# EAGLE design nled-dis-oled-v1a (EAGLE 9.1.0)
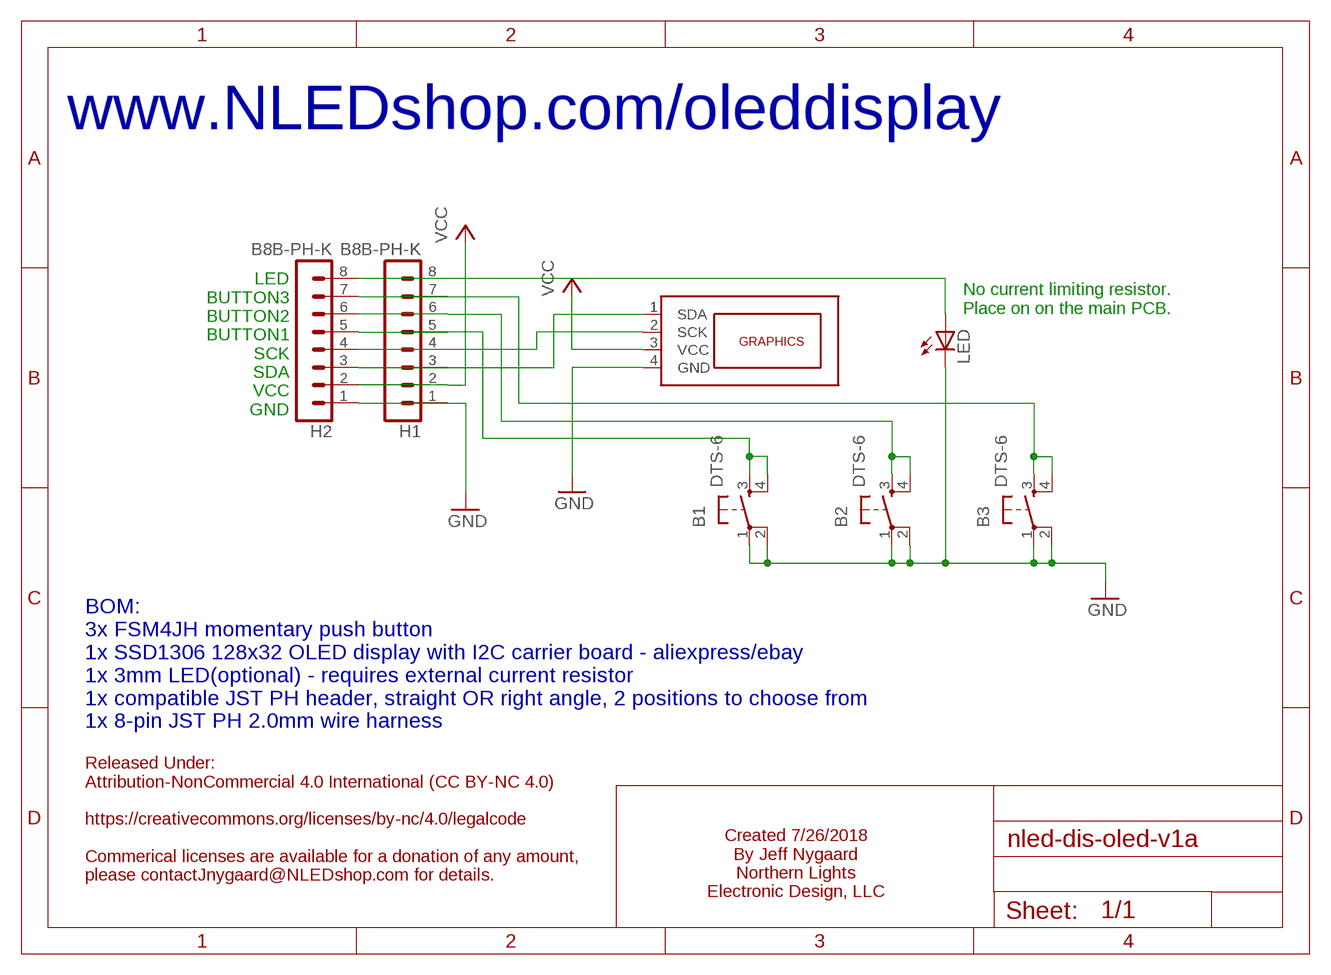
[diagram p0: schematic, sheet 1]

## Parts
B1  DTS-6  [DTS-6]
B2  DTS-6  [DTS-6]
B3  DTS-6  [DTS-6]
H1  B8B-PH-K  [B8B-PH-K]
H2  B8B-PH-K  [B8B-PH-K]
LED  LED3MM  [LED3MM]
OLED  OLED-128X32  [OLED-128X32]

## Nets
GND: B1.1 B1.2 B2.1 B2.2 B3.1 B3.2 H1.1 H2.1 LED.K(C) OLED.4(GND)
N$2: H1.8 H2.8 LED.A
N$3: B1.3 B1.4 H1.5 H2.5
N$4: B2.3 B2.4 H1.6 H2.6
N$5: B3.3 B3.4 H1.7 H2.7
N$8: H1.3 H2.3 OLED.1(SDA)
N$9: H1.4 H2.4 OLED.2(SCK)
VCC: H1.2 H2.2 OLED.3(VCC)

## Notes on the sheet
- www.NLEDshop.com/oleddisplay
- No current limiting resistor.
  Place on on the main PCB.
- LED
  BUTTON3
  BUTTON2
  BUTTON1
  SCK
  SDA
  VCC
  GND
- BOM:
  3x FSM4JH momentary push button
  1x SSD1306 128x32 OLED display with I2C carrier board - aliexpress/ebay
  1x 3mm LED(optional) - requires external current resistor
  1x compatible JST PH header, straight OR right angle, 2 positions to choose from
  1x 8-pin JST PH 2.0mm wire harness
- Created 7/26/2018
  By Jeff Nygaard
  Northern Lights
  Electronic Design, LLC
- Released Under:
  Attribution-NonCommercial 4.0 International (CC BY-NC 4.0)
  
  https://creativecommons.org/licenses/by-nc/4.0/legalcode
  
  Commerical licenses are available for a donation of any amount,
  please contactJnygaard@NLEDshop.com for details.

## Library data of the parts
B1-B3 = switch-tact:DTS-6
H1 H2 = con-jst-ph:B8B-PH-K: HEADER
LED = led:LED: LED OSRAM: - CHIPLED LG R971, LG N971, LY N971, LG Q971, LY Q971, LO R971, LY R971 LH N974, LH R974 LS Q976, LO Q976, LY Q976 LO Q996 - Hyper CHIPLED LW Q18S LB Q993, LB Q99A, LB R99A - SideLED LS A670, LO A670, LY A670, LG A670, LP A670 LB A673, LV A673, LT A673, LW A673 LH A674 LY A675 LS A676, LA A676, LO A676, LY A676, LW A676 LS A679, LY A679, LG A679 - Hyper Micro SIDELED® LS Y876, LA Y876, LO Y876, LY Y876 LT Y87S - SmartLED LW L88C, LW L88S LB L89C, LB L89S, LG L890 LS L89K, LO L89K, LY L89K LS L896, LA L896, LO L896, LY L896 - TOPLED LS T670, LO T670, LY T670, LG T670, LP T670 LSG T670, LSP T670, LSY T670, LOP T670, LYG T670 LG T671, LOG T671, LSG T671 LB T673, LV T673, LT T673, LW T673 LH T674 LS T676, LA T676, LO T676, LY T676, LB T676, LH T676, LSB T676, LW T676 LB T67C, LV T67C, LT T67C, LS T67K, LO T67K, LY T67K, LW E67C LS E67B, LA E67B, LO E67B, LY E67B, LB E67C, LV E67C, LT E67C LW T67C LS T679, LY T679, LG T679 LS T770, LO T770, LY T770, LG T770, LP T770 LB T773, LV T773, LT T773, LW T773 LH T774 LS E675, LA E675, LY E675, LS T675 LS T776, LA T776, LO T776, LY T776, LB T776 LHGB T686 LT T68C, LB T68C - Hyper Mini TOPLED® LB M676 - Mini TOPLED Santana® LG M470 LS M47K, LO M47K, LY M47K Source: http://www.osram.convergy.de LUXEON: - LUMILED® LXK2-PW12-R00, LXK2-PW12-S00, LXK2-PW14-U00, LXK2-PW14-V00 LXK2-PM12-R00, LXK2-PM12-S00, LXK2-PM14-U00 LXK2-PE12-Q00, LXK2-PE12-R00, LXK2-PE12-S00, LXK2-PE14-T00, LXK2-PE14-U00 LXK2-PB12-K00, LXK2-PB12-L00, LXK2-PB12-M00, LXK2-PB14-N00, LXK2-PB14-P00, LXK2-PB14-Q00 LXK2-PR12-L00, LXK2-PR12-M00, LXK2-PR14-Q00, LXK2-PR14-R00 LXK2-PD12-Q00, LXK2-PD12-R00, LXK2-PD12-S00 LXK2-PH12-R00, LXK2-PH12-S00 LXK2-PL12-P00, LXK2-PL12-Q00, LXK2-PL12-R00 Source: www.luxeon.com KINGBRIGHT: KA-3528ASYC Source: www.kingbright.com
OLED = NLED-modules:OLED-128X32

## Board
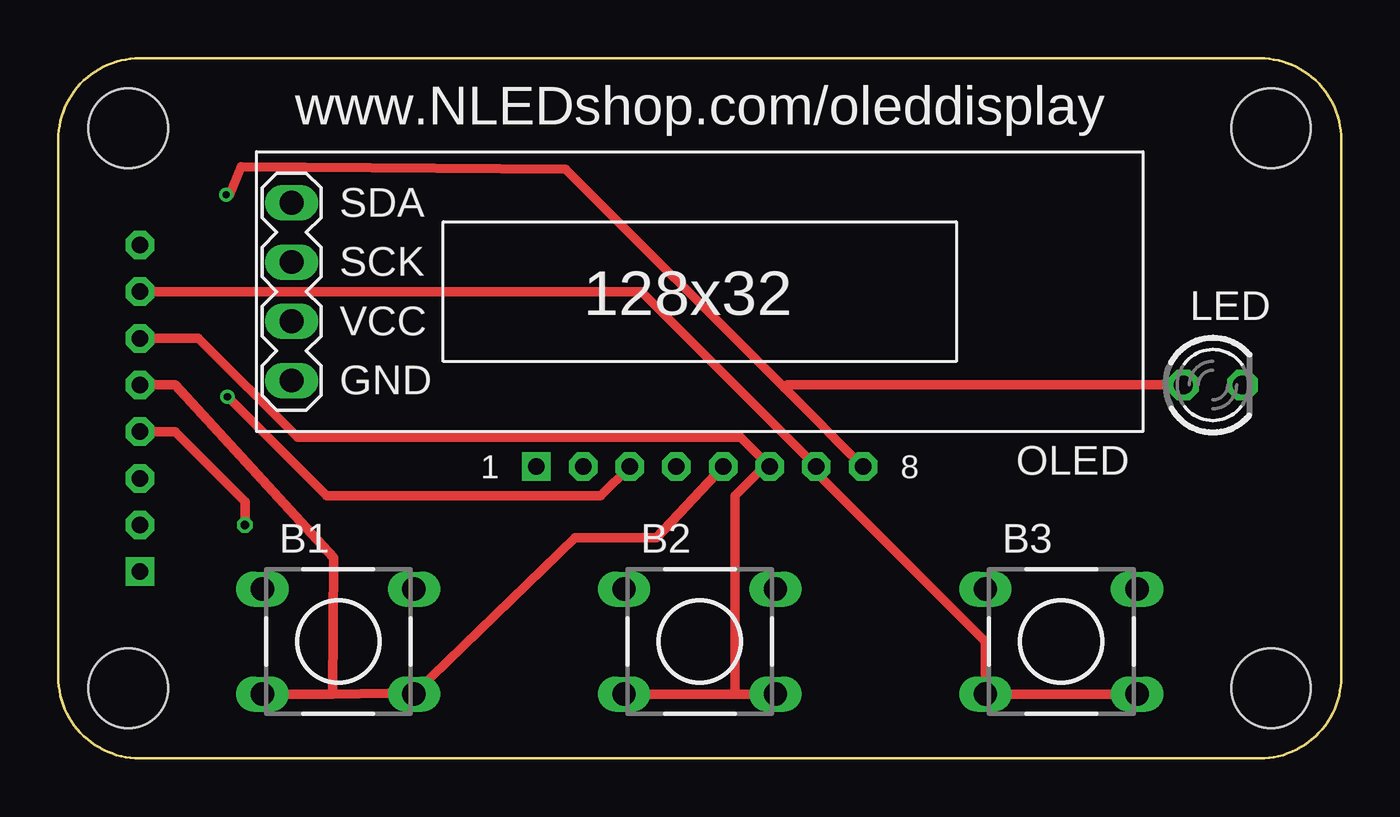
[diagram p1: board, top side]
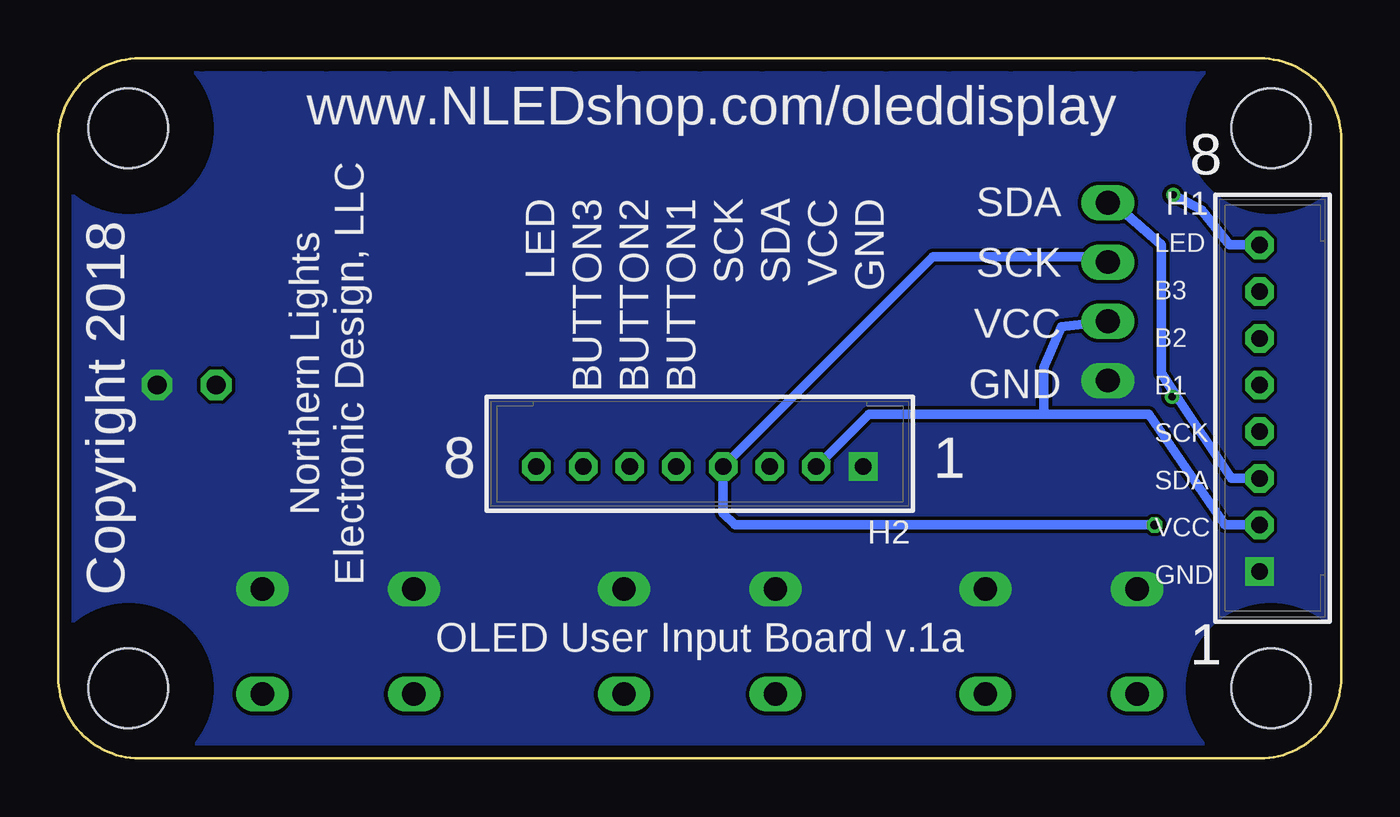
[diagram p2: board, bottom side, seen from below]

Size 55 x 30 mm. Coordinates in mm from the lower left corner, seen from the top.
Outline: 55,3.29 54.98,3.09 54.95,2.89 54.91,2.69 54.86,2.49 54.79,2.3 54.72,2.11 54.63,1.93 54.53,1.75 54.43,1.57 54.31,1.41 54.18,1.25 54.05,1.09 53.91,0.95 53.75,0.82 53.59,0.69 53.43,0.57 53.25,0.47 53.08,0.37 52.89,0.28 52.7,0.21 52.51,0.14 52.31,0.09 52.11,0.05 51.91,0.02 51.71,0 51.5,0 48.83,0 46.17,0 43.5,0 40.84,0 38.17,0 35.5,0 32.84,0 30.17,0 27.5,0 24.84,0 22.17,0 19.5,0 16.84,0 14.17,0 11.5,0 8.84,0 6.17,0 3.5,0 3.29,0 3.09,0.02 2.89,0.05 2.69,0.09 2.49,0.14 2.3,0.21 2.11,0.28 1.93,0.37 1.75,0.47 1.57,0.57 1.41,0.69 1.25,0.82 1.09,0.95 0.95,1.09 0.82,1.25 0.69,1.41 0.57,1.57 0.47,1.75 0.37,1.93 0.28,2.11 0.21,2.3 0.14,2.49 0.09,2.69 0.05,2.89 0.02,3.09 0,3.29 0,3.5 0,4.78 0,6.05 0,7.33 0,8.61 0,9.89 0,11.16 0,12.44 0,13.72 0,15 0,16.27 0,17.55 0,18.83 0,20.11 0,21.39 0,22.66 0,23.94 0,25.22 0,26.5 0,26.71 0.02,26.91 0.05,27.11 0.09,27.31 0.14,27.51 0.21,27.7 0.28,27.89 0.37,28.07 0.47,28.25 0.57,28.43 0.69,28.59 0.82,28.75 0.95,28.91 1.09,29.05 1.25,29.18 1.41,29.31 1.57,29.43 1.75,29.53 1.93,29.63 2.11,29.72 2.3,29.79 2.49,29.86 2.69,29.91 2.89,29.95 3.09,29.98 3.29,30 3.5,30 6.17,30 8.83,30 11.5,30 14.16,30 16.83,30 19.5,30 22.16,30 24.83,30 27.5,30 30.16,30 32.83,30 35.5,30 38.16,30 40.83,30 43.5,30 46.16,30 48.83,30 51.5,30 51.71,30 51.91,29.98 52.11,29.95 52.31,29.91 52.51,29.86 52.7,29.79 52.89,29.72 53.08,29.63 53.25,29.53 53.43,29.43 53.59,29.31 53.75,29.18 53.91,29.05 54.05,28.91 54.18,28.75 54.31,28.59 54.43,28.43 54.53,28.25 54.63,28.07 54.72,27.89 54.79,27.7 54.86,27.51 54.91,27.31 54.95,27.11 54.98,26.91 55,26.71 55,26.5 55,25.22 55,23.95 55,22.67 55,21.39 55,20.11 55,18.84 55,17.56 55,16.28 55,15 55,13.73 55,12.45 55,11.17 55,9.89 55,8.61 55,7.34 55,6.06 55,3.29
Outline: 55,3.29 55,3.5
Copper layers (1*16): Top 0.035mm / dielectric 1.5mm / Bottom 0.035mm
Design rules "SeeedStudio_2layer_DRU_no_angle_20140221 *": minimum track width 16mil, minimum drill 12mil, track to track 6mil, track to pad 12mil, pad to pad 6mil, via to via 6mil, smd to smd 0mil, copper to edge 20mil, drill to drill 20mil, minimum pad ring 10mil, minimum via ring 6mil, stop-mask expansion 2mil, vias tented up to drill 100mil, thermal gap 10mil
Holes 3.4 mm at 3,27 3,3 52,3 52,27
bKeepout: area -0.6,-0.6 to 6.6,6.6; area 48.4,-0.6 to 55.6,6.6; area 48.4,23.4 to 55.6,30.6; area -0.6,23.4 to 6.6,30.6
bRestrict: area -0.6,-0.6 to 6.6,6.6; area -0.6,23.4 to 6.6,30.6; area 48.4,23.4 to 55.6,30.6; area 48.4,-0.6 to 55.6,6.6

### Footprints (pad centres in the part's own frame; a part is rotated, then mirrored left to right if it is on the bottom)
DTS-6 = drill 1 long: 1 -3.25,2.25; 2 3.25,2.25; 3 -3.25,-2.25; 4 3.25,-2.25
B8B-PH-K = drill 0.711 square: 1 -7,0 | drill 0.711 octagon: 2 -5,0; 3 -3,0; 4 -1,0; 5 1,0; 6 3,0; 7 5,0; 8 7,0
LED3MM = drill 0.813 octagon: A -1.27,0; K 1.27,0
OLED-128X32 = drill 1.016 long: 1 -17.5,3.81; 2 -17.5,1.27; 3 -17.5,-1.27; 4 -17.5,-3.81

### Placement (x,y rotation side)
B1  12,5 0 top
B2  27.5,5 0 top
B3  43,5 0 top
H1  3.5,15 90 bottom
H2  27.5,12.5 180 bottom
LED  49.5,16 0 top
OLED  27.5,20 0 top

### Tracks (layer width: path | path; a pad name or v marks a point on that pad's centre or on a via)
GND
  pour Bottom (no thermals): 0,30 0,0 55,0 55,30
N$2  (via drill 0.3)
  Top 0.406: v7.2,24.15 7.35,24.15 7.85,25.35 21.75,25.25 31.12,15.88 | H2.8 31.12,15.88 | LED.A 48,16 31.25,16 31.12,15.88
  Bottom 0.406: H1.8 4.8,22 6,23.5 v7.2,24.15
N$3
  Top 0.406: H2.5 25.65,9.45 22.15,9.45 15.3,2.8 | B1.4 15.3,2.8 | 15.3,2.8 11.75,2.75 | 11.75,2.75 11.8,8.6 5,16 H1.5 | 11.75,2.75 B1.3
N$4
  Top 0.406: B2.4 29,2.75 | 29,2.75 B2.3 | H1.6 6,18 10.25,13.75 29.25,13.75 H2.6 30.25,12.5 29,11.25 29,2.75
N$5
  Top 0.406: B3.4 B3.3 39.75,5 32.25,12.5 H2.7 25,20 H1.7
N$8  (via drill 0.3)
  Top 0.406: H2.3 23.25,11.25 11.5,11.25 v7.25,15.5
  Bottom 0.406: 7.12,15.62 7.7,16.5 7.7,22 10,24 OLED.1 | 7.12,15.62 4.7,12 H1.3 | v7.25,15.5 7.12,15.62
N$9  (via drill 0.35)
  Top 0.406: H1.4 5,14 8,11 v8,10
  Bottom 0.406: OLED.2 10,21.5 17.5,21.5 H2.4 26.5,10.5 26,10 v8,10
VCC
  Bottom 0.406: H1.2 5,10 8.25,14.75 12.75,14.75 | 12.75,14.75 12.75,16.75 12,18.5 OLED.3 | H2.2 20.25,14.75 12.75,14.75

### Text on the board
tNames: www.NLEDshop.com/oleddisplay | 1 | 8
bNames: www.NLEDshop.com/oleddisplay | 8 | SDA / SCK / VCC / GND | LED / BUTTON3 / BUTTON2 / BUTTON1 / SCK / SDA / VCC / GND | LED / B3 / B2 / B1 / SCK / SDA / VCC / GND | Northern Lights / Electronic Design, LLC | Copyright 2018 | 1 | 8 | OLED User Input Board v.1a | 1